# Altium schematic sheet main.SchDoc
size A2
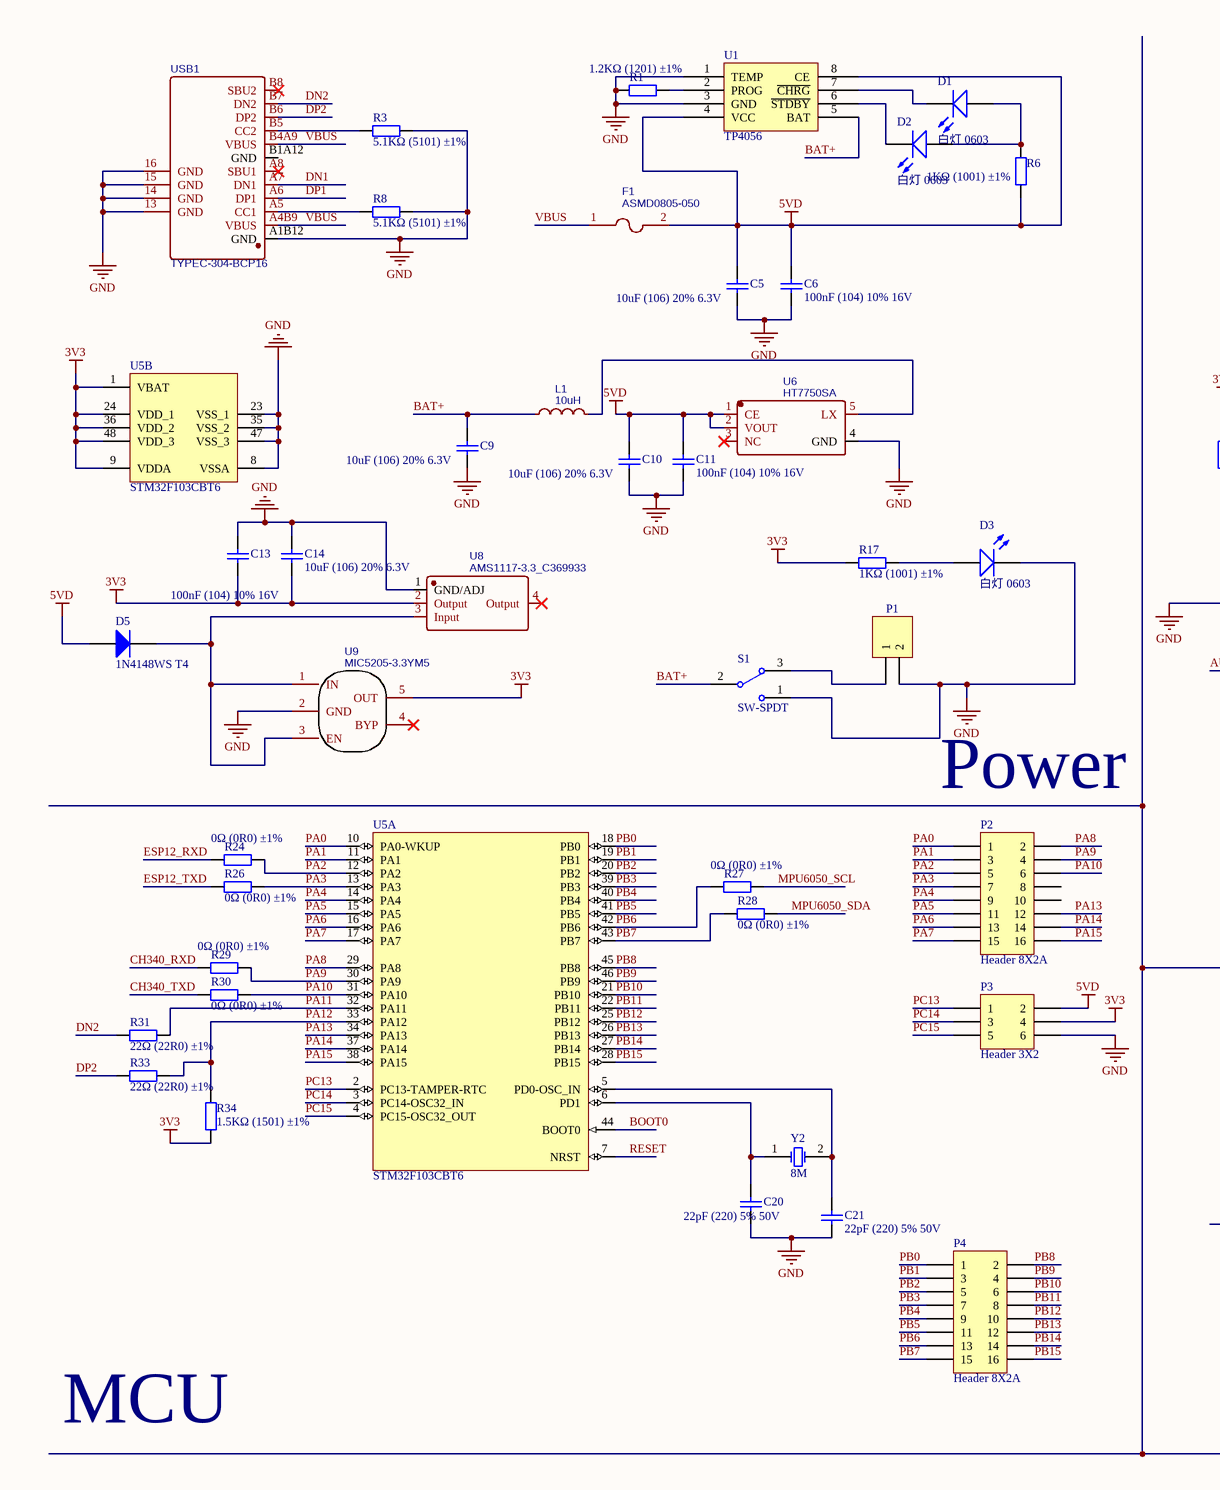
[diagram p0: main.SchDoc, left]
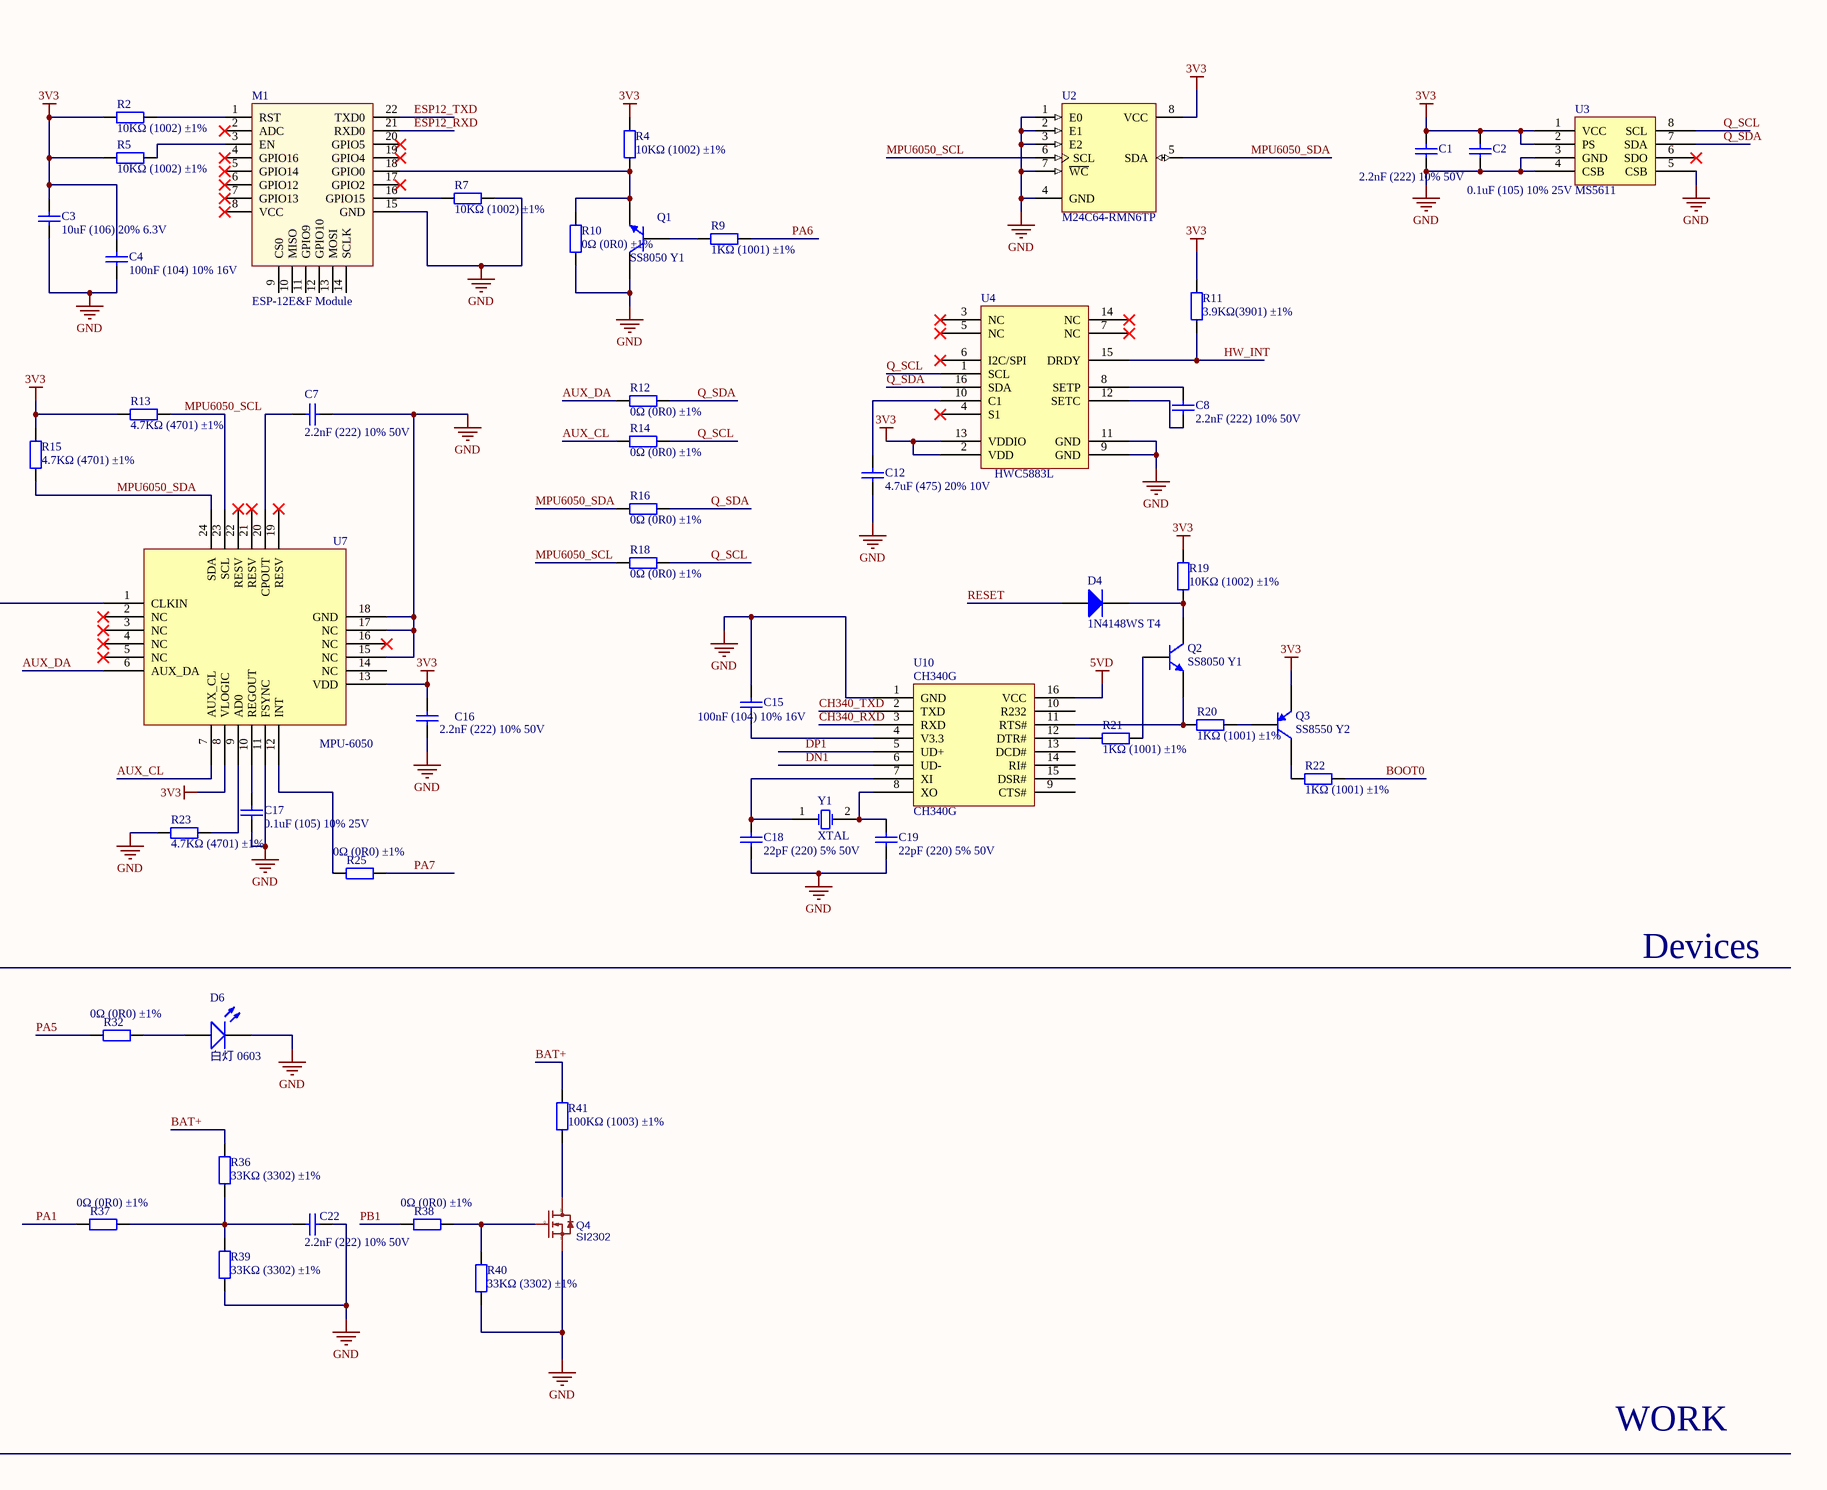
[diagram p1: main.SchDoc, right]

## Parts
C1  2.2nF (222) 10% 50V  [0402_C]
C2  0.1uF (105) 10% 25V  [0402_C]
C3  10uF (106) 20% 6.3V  [0402_C]
C4  100nF (104) 10% 16V  [0402_C]
C5  10uF (106) 20% 6.3V  [0402_C]
C6  100nF (104) 10% 16V  [0402_C]
C7  2.2nF (222) 10% 50V  [0402_C]
C8  2.2nF (222) 10% 50V  [0402_C]
C9  10uF (106) 20% 6.3V  [0402_C]
C10  10uF (106) 20% 6.3V  [0402_C]
C11  100nF (104) 10% 16V  [0402_C]
C12  4.7uF (475) 20% 10V  [0402_C]
C13  100nF (104) 10% 16V  [0402_C]
C14  10uF (106) 20% 6.3V  [0402_C]
C15  100nF (104) 10% 16V  [0402_C]
C16  2.2nF (222) 10% 50V  [0402_C]
C17  0.1uF (105) 10% 25V  [0402_C]
C18  22pF (220) 5% 50V  [0402_C]
C19  22pF (220) 5% 50V  [0402_C]
C20  22pF (220) 5% 50V  [0402_C]
C21  22pF (220) 5% 50V  [0402_C]
C22  2.2nF (222) 10% 50V  [0402_C]
D1  白灯 0603  [0603_LED_S1]
D2  白灯 0603  [0603_LED_S1]
D3  白灯 0603  [0603_LED_S1]
D4  1N4148WS T4  [SOD-323_L1.8-W1.3-LS2.5-RD]
D5  1N4148WS T4  [SOD-323_L1.8-W1.3-LS2.5-RD]
D6  白灯 0603  [0603_LED_S1]
F1  ASMD0805-050  [F0805]
L1  10uH  [IND-SMD_L3.0-W3.0_SWPA3010S]
M1  ESP-12E&F Module  [ESP-12E&F Module]
P1  Header 2  [HDR2X1_A]  (value not drawn)
P2  Header 8X2A  [HDR8X2_A1]
P3  Header 3X2  [HDR2X3]
P4  Header 8X2A  [HDR8X2_A1]
Q1  SS8050 Y1  [SOT-23(SOT-23-3)]
Q2  SS8050 Y1  [SOT-23(SOT-23-3)]
Q3  SS8550 Y2  [SOT-23(SOT-23-3)]
Q4  SI2302  [SOT-23-3_L2.9-W1.3-P1.90-LS2.4-BR]
R1  1.2KΩ (1201) ±1%  [0402_R]
R2  10KΩ (1002) ±1%  [0402_R]
R3  5.1KΩ (5101) ±1%  [0402_R]
R4  10KΩ (1002) ±1%  [0402_R]
R5  10KΩ (1002) ±1%  [0402_R]
R6  1KΩ (1001) ±1%  [0402_R]
R7  10KΩ (1002) ±1%  [0402_R]
R8  5.1KΩ (5101) ±1%  [0402_R]
R9  1KΩ (1001) ±1%  [0402_R]
R10  0Ω (0R0) ±1%  [0402_R]
R11  3.9KΩ(3901) ±1%  [0402_R]
R12  0Ω (0R0) ±1%  [0402_R]
R13  4.7KΩ (4701) ±1%  [0402_R]
R14  0Ω (0R0) ±1%  [0402_R]
R15  4.7KΩ (4701) ±1%  [0402_R]
R16  0Ω (0R0) ±1%  [0402_R]
R17  1KΩ (1001) ±1%  [0402_R]
R18  0Ω (0R0) ±1%  [0402_R]
R19  10KΩ (1002) ±1%  [0402_R]
R20  1KΩ (1001) ±1%  [0402_R]
R21  1KΩ (1001) ±1%  [0402_R]
R22  1KΩ (1001) ±1%  [0402_R]
R23  4.7KΩ (4701) ±1%  [0402_R]
R24  0Ω (0R0) ±1%  [0402_R]
R25  0Ω (0R0) ±1%  [0402_R]
R26  0Ω (0R0) ±1%  [0402_R]
R27  0Ω (0R0) ±1%  [0402_R]
R28  0Ω (0R0) ±1%  [0402_R]
R29  0Ω (0R0) ±1%  [0402_R]
R30  0Ω (0R0) ±1%  [0402_R]
R31  22Ω (22R0) ±1%  [0402_R]
R32  0Ω (0R0) ±1%  [0402_R]
R33  22Ω (22R0) ±1%  [0402_R]
R34  1.5KΩ (1501) ±1%  [0402_R]
R36  33KΩ (3302) ±1%  [0402_R]
R37  0Ω (0R0) ±1%  [0402_R]
R38  0Ω (0R0) ±1%  [0402_R]
R39  33KΩ (3302) ±1%  [0402_R]
R40  33KΩ (3302) ±1%  [0402_R]
R41  100KΩ (1003) ±1%  [0805_R]
S1  SW-SPDT  [SWITCH_A1]
U1  TP4056  [SOP-8_EP_150mil]
U2  M24C64-RMN6TP  [SOIC-8_150mil]
U3  MS5611  [MS5611 - duplicate]
U4  HWC5883L  [LPCC-16_L3.0-W3.0-P0.50-BL]
U5  STM32F103CBT6  [LQFP-48_7x7x05P]  (parts A,B of 2)
U6  HT7750SA  [SOT-23-5]
U7  MPU-6050  [QFN-24_4x4x05P]
U8  AMS1117-3.3_C369933  [SOT-223-3_L6.5-W3.4-P2.30-LS7.0-BR]
U9  MIC5205-3.3YM5  [SOT-23-5]
U10  CH340G  [SOIC-16_L9.9-W3.9-P1.27-LS6.0-BR]
USB1  TYPEC-304-BCP16  [USB-C-SMD_TYPEC-304-BCP16]
Y1  XTAL  [XTAL_socket]
Y2  8M  [XTAL_socket]

## Nets
3V3: C1.2 C2.2 C3.2 C4.2 C13.1 C14.1 C16.2 P3.4 Q3.2(E) R2.1 R4.2 R5.1 R11.2 R13.1 R15.2 R17.1 R19.2 R34.1 U2.8(VCC) U3.1(VCC) U3.2(PS) U4.2(VDD) U4.13(VDDIO) U5.1(VBAT) U5.9(VDDA) U5.24(VDD_1) U5.36(VDD_2) U5.48(VDD_3) U7.8(VLOGIC) U7.13(VDD) U8.2(Output) U9.5(OUT)
5VD: C5.2 C6.2 C10.2 C11.2 D5.1(A) F1.2 P3.2 R6.1 U1.4(VCC) U1.8(CE) U6.1(CE) U6.2(VOUT) U10.16(VCC)
GND: C1.1 C2.1 C3.1 C4.1 C5.1 C6.1 C7.2 C9.1 C10.1 C11.1 C12.1 C13.2 C14.2 C15.2 C16.1 C17.1 C18.1 C19.1 C20.1 C21.1 C22.2 D3.K D6.K M1.15(GND) P1.2 P3.6 Q1.3(C) Q4.2(S) R1.1 R3.1 R7.2 R8.1 R10.1 R23.2 R39.1 R40.1 S1.1 U1.1(TEMP) U1.3(GND) U2.1(E0) U2.2(E1) U2.3(E2) U2.4(GND) U2.7(~{WC}) U3.3(GND) U3.4(CSB) U3.5(CSB) U4.9(GND) U4.11(GND) U5.8(VSSA) U5.23(VSS_1) U5.35(VSS_2) U5.47(VSS_3) U6.4(GND) U7.1(CLKIN) U7.11(FSYNC) U7.15(NC) U7.17(NC) U7.18(GND) U8.1(GND/ADJ) U9.2(GND) U10.1(GND) USB1.13(GND) USB1.14(GND) USB1.15(GND) USB1.16(GND) USB1.A1B12(GND)
AUX_CL: R14.1 U7.7(AUX_CL)
AUX_DA: R12.1 U7.6(AUX_DA)
BAT+: C9.2 L1.1 R36.2 R41.2 S1.2 U1.5(BAT)
BOOT0: R22.1 U5.44(BOOT0)
CH340_RXD: R29.1 U10.3(RXD)
CH340_TXD: R30.1 U10.2(TXD)
DN1: U10.6(UD-) USB1.A7(DN1)
DN2: R31.1 USB1.B7(DN2)
DP1: U10.5(UD+) USB1.A6(DP1)
DP2: R33.1 USB1.B6(DP2)
ESP12_RXD: M1.21(RXD0) R24.1
ESP12_TXD: M1.22(TXD0) R26.1
HW_INT: R11.1 U4.15(DRDY)
MPU6050_SCL: R13.2 R18.1 R27.2 U2.6(SCL) U7.23(SCL)
MPU6050_SDA: R15.1 R16.1 R28.2 U2.5(SDA) U7.24(SDA)
PA0: P2.1 U5.10(PA0-WKUP)
PA1: P2.3 R37.1 U5.11(PA1)
PA2: P2.5 R24.2 U5.12(PA2)
PA3: P2.7 R26.2 U5.13(PA3)
PA4: P2.9 U5.14(PA4)
PA5: P2.11 R32.1 U5.15(PA5)
PA6: P2.13 R9.2 U5.16(PA6)
PA7: P2.15 R25.2 U5.17(PA7)
PA8: P2.2 U5.29(PA8)
PA9: P2.4 R29.2 U5.30(PA9)
PA10: P2.6 R30.2 U5.31(PA10)
PA11: R31.2 U5.32(PA11)
PA12: R33.2 R34.2 U5.33(PA12)
PA13: P2.12 U5.34(PA13)
PA14: P2.14 U5.37(PA14)
PA15: P2.16 U5.38(PA15)
PB0: P4.1 U5.18(PB0)
PB1: P4.3 R38.1 U5.19(PB1)
PB2: P4.5 U5.20(PB2)
PB3: P4.7 U5.39(PB3)
PB4: P4.9 U5.40(PB4)
PB5: P4.11 U5.41(PB5)
PB6: P4.13 R27.1 U5.42(PB6)
PB7: P4.15 R28.1 U5.43(PB7)
PB8: P4.2 U5.45(PB8)
PB9: P4.4 U5.46(PB9)
PB10: P4.6 U5.21(PB10)
PB11: P4.8 U5.22(PB11)
PB12: P4.10 U5.25(PB12)
PB13: P4.12 U5.26(PB13)
PB14: P4.14 U5.27(PB14)
PB15: P4.16 U5.28(PB15)
PC13: P3.1 U5.2(PC13-TAMPER-RTC)
PC14: P3.3 U5.3(PC14-OSC32_IN)
PC15: P3.5 U5.4(PC15-OSC32_OUT)
Q_SCL: R14.2 R18.2 U3.8(SCL) U4.1(SCL)
Q_SDA: R12.2 R16.2 U3.7(SDA) U4.16(SDA)
RESET: D4.1(A) U5.7(NRST)
VBUS: F1.1 USB1.A4B9(VBUS) USB1.B4A9(VBUS)
NetC7_1: C7.1 U7.20(CPOUT)
NetC8_1: C8.1 U4.12(SETC)
NetC8_2: C8.2 U4.8(SETP)
NetC12_2: C12.2 U4.10(C1)
NetC15_1: C15.1 U10.4(V3.3)
NetC17_2: C17.2 U7.10(REGOUT)
NetC18_2: C18.2 U10.7(XI) Y1.1(OSC1)
NetC19_2: C19.2 U10.8(XO) Y1.2(OSC2)
NetC20_2: C20.2 U5.6(PD1) Y2.1(OSC1)
NetC21_2: C21.2 U5.5(PD0-OSC_IN) Y2.2(OSC2)
NetC22_1: C22.1 R36.1 R37.2 R39.2
NetD1_A: D1.A D2.A R6.2
NetD1_K: D1.K U1.7(~{CHRG})
NetD2_K: D2.K U1.6(~{STDBY})
NetD3_A: D3.A R17.2
NetD4_2: D4.2(K) Q2.3(C) R19.1
NetD5_2: D5.2(K) U8.3(Input) U9.1(IN) U9.3(EN)
NetD6_A: D6.A R32.2
NetL1_2: L1.2 U6.5(LX)
NetM1_1: M1.1(RST) R2.2
NetM1_3: M1.3(EN) R5.2
NetM1_16: M1.16(GPIO15) R7.1
NetM1_18: M1.18(GPIO0) Q1.2(E) R4.1 R10.2
NetP1_1: P1.1 S1.3
NetQ1_1: Q1.1(B) R9.1
NetQ2_1: Q2.1(B) R21.2
NetQ2_2: Q2.2(E) R20.1 U10.11(RTS#)
NetQ3_1: Q3.1(B) R20.2
NetQ3_3: Q3.3(C) R22.2
NetQ4_1: Q4.1(G) R38.2 R40.2
NetQ4_3: Q4.3(D) R41.1
NetR1_2: R1.2 U1.2(PROG)
NetR3_2: R3.2 USB1.B5(CC2)
NetR8_2: R8.2 USB1.A5(CC1)
NetR21_1: R21.1 U10.12(DTR#)
NetR23_1: R23.1 U7.9(AD0)
NetR25_1: R25.1 U7.12(INT)

Not connected (* = marked no-connect by the designer): M1 2(ADC)* 4(GPIO16)* 5(GPIO14)* 6(GPIO12)* 7(GPIO13)* 8(VCC)* 9(CS0) 10(MISO) 11(GPIO9) 12(GPIO10) 13(MOSI) 14(SCLK) 17(GPIO2)* 19(GPIO4)* 20(GPIO5)*; P2 8 10; U3 6(SDO)*; U4 3(NC)* 4(S1)* 5(NC)* 6(I2C/SPI)* 7(NC)* 14(NC)*; U6 3(NC)*; U7 2(NC)* 3(NC)* 4(NC)* 5(NC)* 14(NC) 16(NC)* 19(RESV)* 21(RESV)* 22(RESV)*; U8 4(Output)*; U9 4(BYP)*; U10 9(CTS#) 10(R232) 13(DCD#) 14(RI#) 15(DSR#); USB1 A8(SBU1)* B1A12(GND) B8(SBU2)*

## Notes on the sheet
- (near P2) Power
- Devices
- MCU
- WORK
- Title
- Size:
- Date:
- File:
- A2
- Number:
- Time:
- Revision:
- Sheet
- of

## Library data of the parts
C1 C7 C8 C16 C22 = 0402 2.2nF (222) 10% 50V: 贴片电容; ComponentLink1Description: 供应商链接; ComponentLink1URL: http://www.szlcsc.com/product/details_1883.html; Package: 0402; Supplier: LC; SuppliersPartNumber: C1531
C2 C17 = 0402 1.0uF (105) 10% 25V: 贴片电容; ComponentLink1Description: 供应商链接; ComponentLink1URL: http://www.szlcsc.com/product/details_53938.html; Package: 0402; Supplier: LC; SuppliersPartNumber: C52923
C3 C5 C9 C10 C14 = 0402 10uF (106) 20% 6.3V: 贴片电容; ComponentLink1Description: 供应商链接; ComponentLink1URL: http://www.szlcsc.com/product/details_16204.html; Package: 0402; Supplier: LC; SuppliersPartNumber: C15525
C4 C6 C11 C13 C15 = 0402 100nF (104) 10% 16V: 贴片电容; ComponentLink1Description: 供应商链接; ComponentLink1URL: http://www.szlcsc.com/product/details_1877.html; Package: 0402; Supplier: LC; SuppliersPartNumber: C1525
C12 = 0402 4.7uF (475) 20% 10V: 贴片电容; ComponentLink1Description: 供应商链接; ComponentLink1URL: http://www.szlcsc.com/product/details_24469.html; Package: 0402; Supplier: LC; SuppliersPartNumber: C23733
C18-C21 = 0402 22pF (220) 5% 50V: 贴片电容; ComponentLink1Description: 供应商链接; ComponentLink1URL: http://www.szlcsc.com/product/details_1907.html; Package: 0402; Supplier: LC; SuppliersPartNumber: C1555
D1-D3 D6 = 0603 白灯: 发光二极管; ComponentLink1Description: 供应商链接; ComponentLink1URL: http://www.szlcsc.com/product/details_2663.html; Package: 0603; Supplier: LC; SuppliersPartNumber: C2290
D4 D5 = SOD-323 1N4148WS T4: 二极管; ComponentLink1Description: 供应商链接; ComponentLink1URL: http://www.szlcsc.com/product/details_2485.html; Package: SOD-323; Supplier: LC; SuppliersPartNumber: C2128
F1 = ASMD0805-050: BOM_Manufacturer: JDTFUSE; Contributor: LCSC; BOM_Supplier: LCSC; BOM_Manufacturer Part: ASMD0805-050; BOM_Supplier Part: C135329; spicePre: F; spiceSymbolName: ASMD0805-050
L1 = 10uH: BOM_Manufacturer: Sunlord; BOM_Manufacturer Part: SWPA3012S100MT; nameAlias: Inductance; BOM_Supplier: LCSC; BOM_Supplier Part: C48668; BOM_JLCPCB Part Class: Extended Part; spicePre: L; spiceSymbolName: SWPA3012S100MT
P1 = Header 2: 接插件; LatestRevisionDate: 17-Jul-2002; LatestRevisionNote: Re-released for DXP Platform.; Publisher: Altium Limited
P2 P4 = Header 8X2A: 接插件; LatestRevisionDate: 17-Jul-2002; LatestRevisionNote: Re-released for DXP Platform.; Publisher: Altium Limited
P3 = Header 3X2: Header, 3-Pin, Dual row; LatestRevisionDate: 17-Jul-2002; LatestRevisionNote: Re-released for DXP Platform.; Publisher: Altium Limited
Q1 Q2 = SOT-23 SS8050 Y1: 三极管; ComponentLink1Description: 供应商链接; ComponentLink1URL: http://www.szlcsc.com/product/details_2507.html; Package: SOT-23; Supplier: LC; SuppliersPartNumber: C2150
Q3 = SOT-23 SS8550 Y2: 三极管; ComponentLink1Description: 供应商链接; ComponentLink1URL: http://www.szlcsc.com/product/details_9037.html; Package: SOT-23; Supplier: LC; SuppliersPartNumber: C8542
Q4 = SI2302: BOM_Manufacturer: Hottech; Contributor: LCSC; BOM_Supplier: LCSC; BOM_Manufacturer Part: SI2302; BOM_Supplier Part: C181087; BOM_JLCPCB Part Class: Extended Part; JLCPCB Part Class: Extended Part; spicePre: Q; spiceSymbolName: SI2302
R1 = 0402 1.2KΩ (1201) 1%: 贴片电阻; ComponentLink1Description: 供应商链接; ComponentLink1URL: http://www.szlcsc.com/product/details_26605.html; Package: 0402; Supplier: LC; SuppliersPartNumber: C25862
R2 R4 R5 R7 R19 = 0402 10KΩ (1002) 1%: 贴片电阻; ComponentLink1Description: 供应商链接; ComponentLink1URL: http://www.szlcsc.com/product/details_26487.html; Package: 0402; Supplier: LC; SuppliersPartNumber: C25744
R3 R8 = 0402 5.1KΩ (5101) 1%: 贴片电阻; ComponentLink1Description: 供应商链接; ComponentLink1URL: http://www.szlcsc.com/product/details_26648.html; Package: 0402; Supplier: LC; SuppliersPartNumber: C25905
R6 R9 R17 R20-R22 = 0402 1KΩ (1001) 1%: 贴片电阻; ComponentLink1Description: 供应商链接; ComponentLink1URL: http://www.szlcsc.com/product/details_12256.html; Package: 0402; Supplier: LC; SuppliersPartNumber: C11702
R10 R12 R14 R16 R18 R24-R30 R32 R37 R38 = 0402 0Ω (0R0) 1%: 贴片电阻; ComponentLink1Description: 供应商链接; ComponentLink1URL: http://www.szlcsc.com/product/details_17853.html; Package: 0402; Supplier: LC; SuppliersPartNumber: C17168
R11 = 0402 3.9KΩ(3901) 1%: 贴片电阻; ComponentLink1Description: 供应商链接; ComponentLink1URL: http://www.szlcsc.com/product/details_52734.html; Package: 0402; Supplier: LC; SuppliersPartNumber: C51721
R13 R15 R23 = 0402 4.7KΩ (4701) 1%: 贴片电阻; ComponentLink1Description: 供应商链接; ComponentLink1URL: http://www.szlcsc.com/product/details_26643.html; Package: 0402; Supplier: LC; SuppliersPartNumber: C25900
R31 R33 = 0402 22Ω (22R0) 1%: 贴片电阻; ComponentLink1Description: 供应商链接; ComponentLink1URL: http://www.szlcsc.com/product/details_25835.html; Package: 0402; Supplier: LC; SuppliersPartNumber: C25092
R34 = 0402 1.5KΩ (1501) 1%: 贴片电阻; ComponentLink1Description: 供应商链接; ComponentLink1URL: http://www.szlcsc.com/product/details_26610.html; Package: 0402; Supplier: LC; SuppliersPartNumber: C25867
R36 R39 R40 = 0402 33KΩ (3302) 1%: 贴片电阻; ComponentLink1Description: 供应商链接; ComponentLink1URL: http://www.szlcsc.com/product/details_26522.html; Package: 0402; Supplier: LC; SuppliersPartNumber: C25779
R41 = 0805 100KΩ (1003) 1%: 贴片电阻; ComponentLink1Description: 供应商链接; ComponentLink1URL: http://www.szlcsc.com/product/details_18095.html; Package: 0805; Supplier: LC; SuppliersPartNumber: C17407
S1 = SW-SPDT: 开关; Published: 24-Mar-1999; LatestRevisionDate: 17-Dec-2003; LatestRevisionNote: Schematic revised, PCB Footprint replaced.; DatasheetDocument: 05-Dec-2000; PackageReference: TL36WW15050; Publisher: Altium Limited; ComponentLink1Description: Manufacturer Link; ComponentLink1URL: http://www.apem.com
U1 = TP4056_[C16581]: 电池电源管理; ComponentLink1Description: 供应商链接; ComponentLink1URL: http://www.szlcsc.com/product/details_17264.html; Package: SOP-8_EP_150mil; Supplier: LC; SuppliersPartNumber: C16581
U2 = M24C64-RMN6TP: EEPROM; ComponentLink1Description: 供应商链接; ComponentLink1URL: http://www.szlcsc.com/product/details_81133.html; Package: SOIC-8_150mil; Supplier: LC; SuppliersPartNumber: C79988
U4 = HMC5883L
U5 = STM32F103CBT6: ARM; ComponentLink1Description: 供应商链接; ComponentLink1URL: http://www.szlcsc.com/product/details_8796.html; Package: LQFP-48_7x7x05P; Supplier: LC; SuppliersPartNumber: C8304
U6 = HT7750SA: BOM_Manufacturer: Holtek Semicon; Contributor: LCSC; BOM_Supplier: LCSC; BOM_Supplier Part: C192571; BOM_Manufacturer Part: HT7750SA; BOM_JLCPCB Part Class: Extended Part; spicePre: U; spiceSymbolName: HT7750SA
U7 = MPU-6050: 传感器; ComponentLink1Description: 供应商链接; ComponentLink1URL: http://www.szlcsc.com/product/details_24852.html; Package: QFN-24_4x4x05P; Supplier: LC; SuppliersPartNumber: C24112
U8 = AMS1117-3.3_C369933: BOM_Manufacturer: KEXIN; Contributor: LCSC; BOM_Paste Type: expand; BOM_Supplier: LCSC; BOM_Supplier Part: C369933; BOM_Manufacturer Part: AMS1117-3.3; spicePre: U; spiceSymbolName: AMS1117-3.3_C369933
U9 = MIC5205-3.3YM5: BOM_Manufacturer: MICROCHIP; BOM_Supplier: LCSC; BOM_Manufacturer Part: MIC5205-3.3YM5; image: //image.lceda.cn/szlcsc/C37970.jpg; BOM_Supplier Part: C37970; BOM_JLCPCB Part Class: Extended Part; spicePre: U; spiceSymbolName: MIC5205-3.3YM5
U10 = CH340G: USB; ComponentLink1Description: 供应商链接; ComponentLink1URL: http://www.szlcsc.com/product/details_14927.html; Package: SOIC-16_150mil; Supplier: LC; SuppliersPartNumber: C14267
USB1 = TYPEC-304-BCP16: BOM_Manufacturer: XUNPU; Contributor: LCSC; BOM_Supplier: LCSC; BOM_Supplier Part: C720629; BOM_Manufacturer Part: TYPEC-304-BCP16; spicePre: U; spiceSymbolName: TYPEC-304-BCP16
Y1 Y2 = XTAL: Crystal Oscillator; Published: 8-Jun-2000; LatestRevisionDate: 17-Jul-2002; LatestRevisionNote: Re-released for DXP Platform.; PackageReference: R38; Publisher: Altium Limited; PackageDescription: Crystal, Thru-Hole; 2 Leads; Body 3.1 x 8.2 mm (Dia.xH)